# Altium schematic sheet CH595X-R0.SchDoc
size 381 x 203 mm
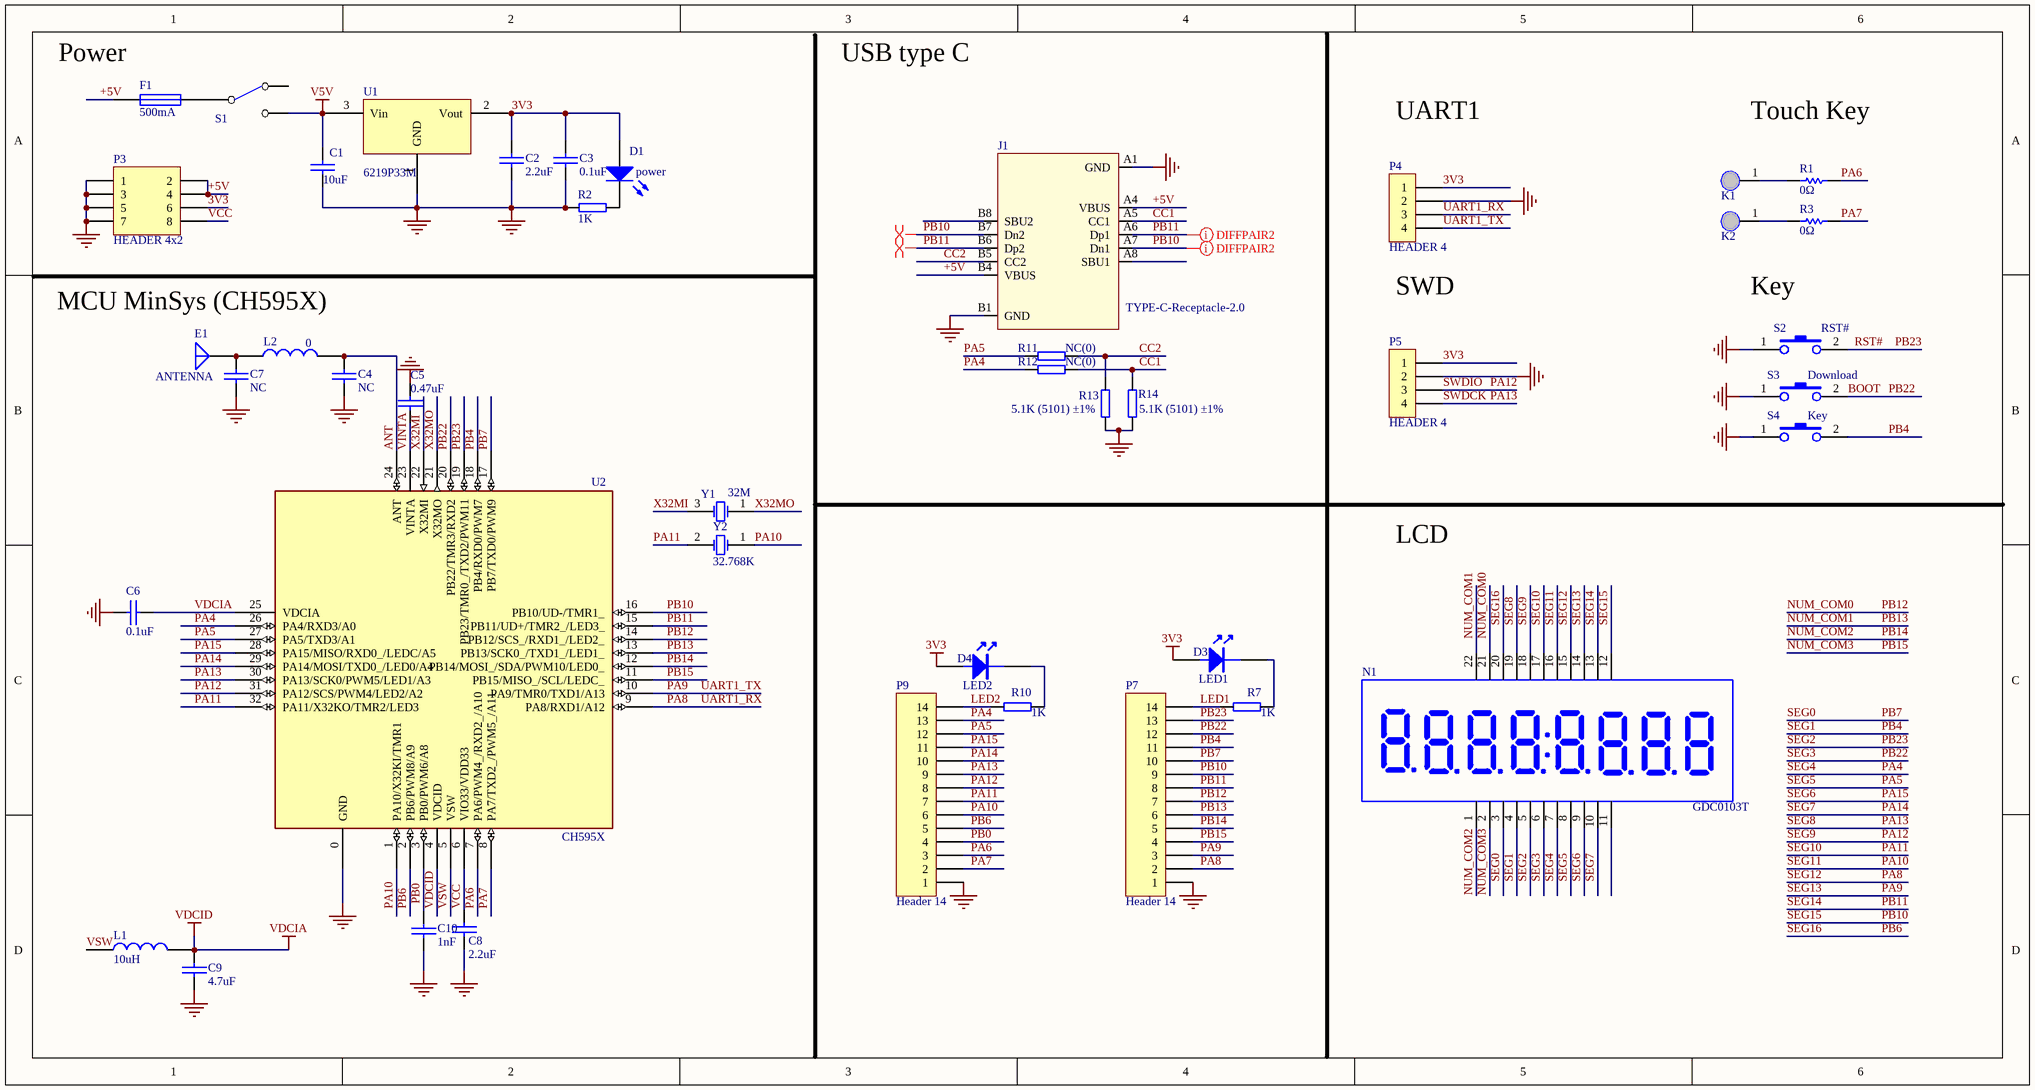
[diagram p0: CH595X-R0.SchDoc]

## Parts
C1  10uF  [0603_C]
C2  2.2uF  [0402_C]
C3  0.1uF  [0402_C]
C4  NC  [0402_C]
C5  0.47uF  [0402_C]
C6  0.1uF  [0402_C]
C7  NC  [0402_C]
C8  2.2uF  [0402_C]
C9  4.7uF  [0402_C]
C10  1nF  [0402_C]
D1  power  [0603+]
D3  LED1  [0603+]
D4  LED2  [0603+]
E1  ANTENNA  [ANT-F-1-2.4G-1.6mmFR4]
F1  500mA  [0603]
J1  TYPE-C-Receptacle-2.0  [TYPE-C-Receptacle-2.0]
K1  TOUCHKEY  [TOUCHKEY-13.6mm-S]  (value not drawn)
K2  TOUCHKEY  [TOUCHKEY-13.6mm-S]  (value not drawn)
L1  10uH  [SMD_2x2mm]
L2  0  [0402]
N1  GDC0103T  [EDC103]
P3  HEADER 4x2  [IDC8-2.54mm]
P4  HEADER 4  [SIP4-2.54mm]
P5  HEADER 4  [SIP4-2.54mm]
P7  Header 14  [SIP14-2.54mm]
P9  Header 14  [SIP14-2.54mm]
R1  0Ω  [0402]
R2  1K  [0402]
R3  0Ω  [0402]
R7  1K  [0402]
R10  1K  [0402]
R11  NC(0)  [0402]
R12  NC(0)  [0402]
R13  5.1K (5101) ±1%  [0402]
R14  5.1K (5101) ±1%  [0402]
S1  SW SPDT  [SW1]  (value not drawn)
S2  RST#  [SMD_6.1x3.65x2.5mm-KEY]
S3  Download  [SMD_6.1x3.65x2.5mm-KEY]
S4  Key  [SMD_6.1x3.65x2.5mm-KEY]
U1  6219P33M  [SOT-23]
U2  CH595X  [QFN32_4X4]
Y1  32M  [XT3225]
Y2  32.768K  [fc-135]

## Nets
3V3: C2.1 C3.1 D1.1(A) D3.1 D4.1 P3.6 P4.1 P5.1 U1.2(Vout)
GND: C1.2 C2.2 C3.2 C4.1 C5.2 C6.2 C7.1 C8.1 C9.1 C10.1 J1.A1(GND) J1.B1(GND) P3.1 P3.3 P3.5 P3.7 P4.2 P5.2 P7.1 P9.1 R2.2 R13.2 R14.2 S2.1 S3.1 S4.1 U1.1(GND) U2.0(GND)
V5V: C1.1 S1.2(NC) U1.3(Vin)
VDCIA: C6.1 C9.2 L1.2 U2.4(VDCID) U2.25(VDCIA)  [also labelled VDCID]
+5V: F1.1 J1.A4(VBUS) J1.B4(VBUS) P3.2 P3.4
ANT: C4.2 L2.2 U2.24(ANT)
BOOT: N1.6 P7.12 S3.2 U2.20(PB22/TMR3/RXD2)  [also labelled PB22, SEG3]
CC1: J1.A5(CC1) R12.2 R14.1
CC2: J1.B5(CC2) R11.2 R13.1
LED1: P7.14 R7.1
LED2: P9.14 R10.1
NUM_COM0: N1.21 P7.7 U2.14(PB12/SCS_/RXD1_/LED2_)  [also labelled PB12]
NUM_COM1: N1.22 P7.6 U2.13(PB13/SCK0_/TXD1_/LED1_)  [also labelled PB13]
NUM_COM2: N1.1 P7.5 U2.12(PB14/MOSI_/SDA/PWM10/LED0_)  [also labelled PB14]
NUM_COM3: N1.2 P7.4 U2.11(PB15/MISO_/SCL/LEDC_)  [also labelled PB15]
PA4: N1.7 P9.13 R12.1 U2.26(PA4/RXD3/A0)  [also labelled SEG4]
PA5: N1.8 P9.12 R11.1 U2.27(PA5/TXD3/A1)  [also labelled SEG5]
PA6: P9.3 R1.1 U2.7(PA6/PWM4_/RXD2_/A10)
PA7: P9.2 R3.1 U2.8(PA7/TXD2_/PWM5_/A11)
PA8: N1.15 P4.3 P7.2 U2.9(PA8/RXD1/A12)  [also labelled SEG12, UART1_RX]
PA9: N1.14 P4.4 P7.3 U2.10(PA9/TMR0/TXD1/A13)  [also labelled SEG13, UART1_TX]
PA10: N1.16 P9.6 U2.1(PA10/X32KI/TMR1) Y2.1(OSC1)  [also labelled SEG11]
PA11: N1.17 P9.7 U2.32(PA11/X32KO/TMR2/LED3) Y2.2(OSC2)  [also labelled SEG10]
PA12: N1.18 P5.3 P9.8 U2.31(PA12/SCS/PWM4/LED2/A2)  [also labelled SEG9, SWDIO]
PA13: N1.19 P5.4 P9.9 U2.30(PA13/SCK0/PWM5/LED1/A3)  [also labelled SEG8, SWDCK]
PA14: N1.10 P9.10 U2.29(PA14/MOSI/TXD0_/LED0/A4)  [also labelled SEG7]
PA15: N1.9 P9.11 U2.28(PA15/MISO/RXD0_/LEDC/A5)  [also labelled SEG6]
PB0: C10.2 P9.4 U2.3(PB0/PWM6/A8)
PB4: N1.4 P7.11 S4.2 U2.18(PB4/RXD0/PWM7)  [also labelled SEG1]
PB6: N1.20 P9.5 U2.2(PB6/PWM8/A9)  [also labelled SEG16]
PB7: N1.3 P7.10 U2.17(PB7/TXD0/PWM9)  [also labelled SEG0]
PB10: J1.A7(Dn1) J1.B7(Dn2) N1.12 P7.9 U2.16(PB10/UD-/TMR1_)  [also labelled SEG15]
PB11: J1.A6(Dp1) J1.B6(Dp2) N1.13 P7.8 U2.15(PB11/UD+/TMR2_/LED3_)  [also labelled SEG14]
PB23: N1.5 P7.13 S2.2 U2.19(PB23/TMR0_/TXD2/PWM11)  [also labelled RST#, SEG2]
VCC: C8.2 P3.8 U2.6(VIO33/VDD33)
VINTA: C5.1 U2.23(VINTA)
VSW: L1.1 U2.5(VSW)
X32MI: U2.22(X32MI) Y1.3(OSC2)
X32MO: U2.21(X32MO) Y1.1(OSC1)
NetC7_2: C7.2 E1.1(A) L2.1
NetD1_2: D1.2(K) R2.1
NetD3_2: D3.2 R7.2
NetD4_2: D4.2 R10.2
NetF1_2: F1.2 S1.1(COMMON)
NetK1_1: K1.1 R1.2
NetK2_1: K2.1 R3.2

Not connected (* = marked no-connect by the designer): J1 A8(SBU1) B8(SBU2); N1 11; S1 3(NO)

## Layout directives
differential pair: PB10, PB11

## Notes on the sheet
- (near F1) Power
- USB type C
- UART1
- Touch Key
- SWD
- Key
- MCU MinSys (CH595X)
- LCD

## Library data of the parts
C1-C10 = CAP: Capacitor
D1 = LED0: Typical INFRARED GaAs LED; Published: 8-Jun-2000; LatestRevisionDate: 08-Jul-2005; LatestRevisionNote: Mech Layer 1 removed.; PackageReference: LED-0; Publisher: Altium Limited; PackageDescription: LED; 2 Leads
D3 D4 = LED
E1 = ANTENNA: Generic Antenna
F1 = FUSE1: Fuse
J1 = TYPE-C-Receptacle-2.0: Type-C USB2.0 母座
L1 L2 = INDUCTOR
N1 = EDC103
P3 = HEADER 4x2: Header, 4-Pin, Dual row
P7 P9 = Header 14: Header, 14-Pin; LatestRevisionDate: 17-Jul-2002; LatestRevisionNote: Re-released for DXP Platform.; Publisher: Altium Limited
R1 R3 = Res Semi: Semiconductor Resistor; Published: 8-Jun-2000; LatestRevisionDate: 17-Jul-2002; LatestRevisionNote: Re-released for DXP Platform.; PackageReference: AXIAL-0.5; Publisher: Altium Limited; Value: 0Ω
R2 R7 R10-R14 = RES
S2-S4 = KEY1
U2 = CH595X: RISC-V MCU with BLE/USB/ADC/SPI/4*UART/I2C/LCD/LEDC
Y1 Y2 = XTAL: Crystal Oscillator; Published: 8-Jun-2000; LatestRevisionDate: 17-Jul-2002; LatestRevisionNote: Re-released for DXP Platform.; PackageReference: R38; Publisher: Altium Limited; PackageDescription: Crystal, Thru-Hole; 2 Leads; Body 3.1 x 8.2 mm (Dia.xH)